# EAGLE design nedo1820_v1_0 (EAGLE 5.01)
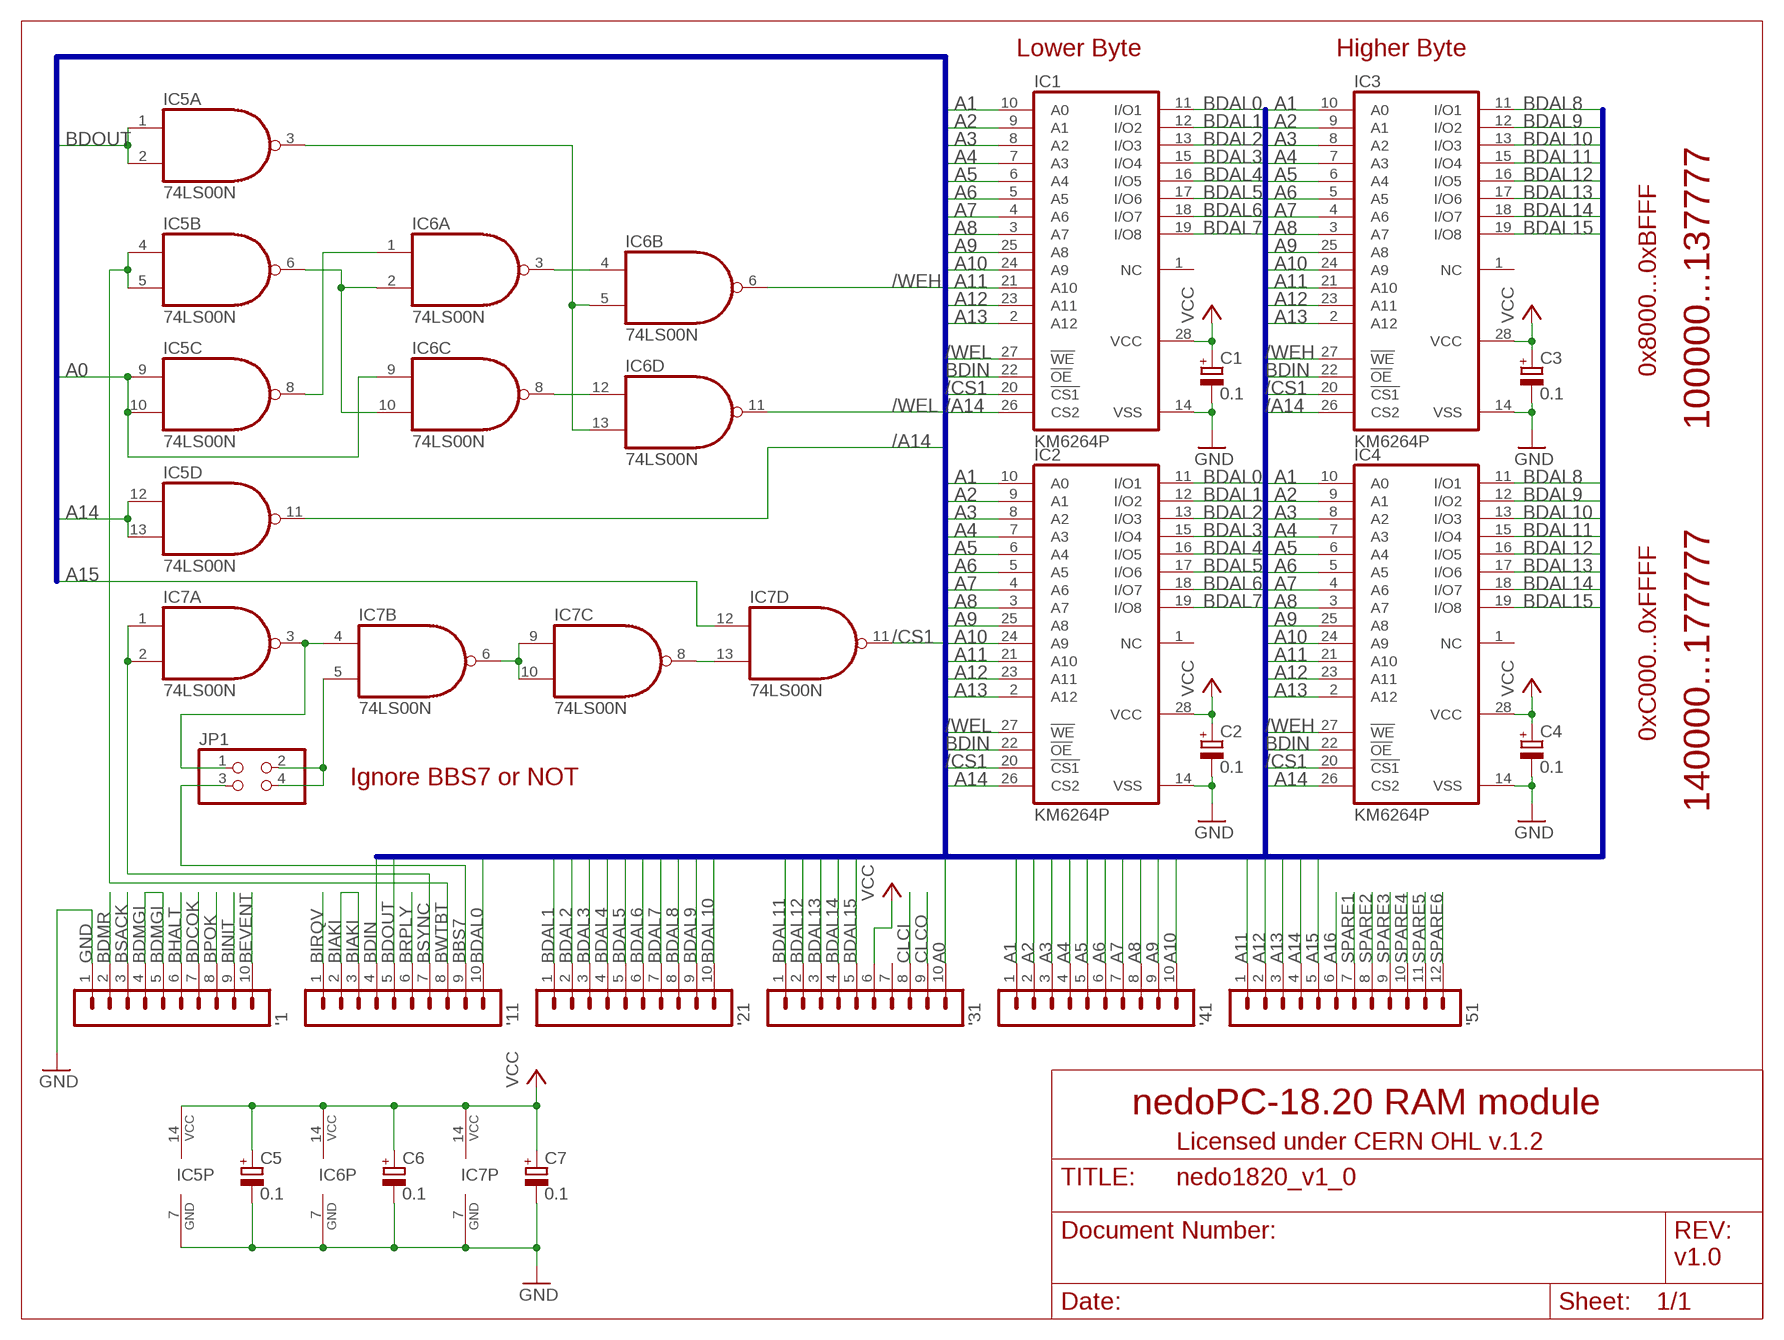
[diagram p0: schematic, sheet 1]

## Parts
'1  MA10-1  [MA10-1]
'11  MA10-1  [MA10-1]
'21  MA10-1  [MA10-1]
'31  MA10-1  [MA10-1]
'41  MA10-1  [MA10-1]
'51  MA12-1  [MA12-1]
C1  0.1  CPOL-EUB45181B  [B45181B]
C2  0.1  CPOL-EUB45181B  [B45181B]
C3  0.1  CPOL-EUB45181B  [B45181B]
C4  0.1  CPOL-EUB45181B  [B45181B]
C5  0.1  CPOL-EUB45181B  [B45181B]
C6  0.1  CPOL-EUB45181B  [B45181B]
C7  0.1  CPOL-EUB45181B  [B45181B]
IC1  KM6264P  6264A  [DIL28-6]
IC2  KM6264P  6264A  [DIL28-6]
IC3  KM6264P  6264A  [DIL28-6]
IC4  KM6264P  6264A  [DIL28-6]
IC5  74LS00N  [DIL14]
IC6  74LS00N  [DIL14]
IC7  74LS00N  [DIL14]
JP1  PINHD-2X2  [2X02]

## Nets
/A14: IC1.26(CS2) IC3.26(CS2) IC5.11(D:O)
/CS1: IC1.20(!CS1) IC2.20(!CS1) IC3.20(!CS1) IC4.20(!CS1) IC7.11(D:O)
/WEH: IC3.27(!WE) IC4.27(!WE) IC6.6(B:O)
/WEL: IC1.27(!WE) IC2.27(!WE) IC6.11(D:O)
A0: '31.10 IC5.9(C:I0) IC5.10(C:I1) IC6.9(C:I0)
A1: '41.1 IC1.10(A0) IC2.10(A0) IC3.10(A0) IC4.10(A0)
A2: '41.2 IC1.9(A1) IC2.9(A1) IC3.9(A1) IC4.9(A1)
A3: '41.3 IC1.8(A2) IC2.8(A2) IC3.8(A2) IC4.8(A2)
A4: '41.4 IC1.7(A3) IC2.7(A3) IC3.7(A3) IC4.7(A3)
A5: '41.5 IC1.6(A4) IC2.6(A4) IC3.6(A4) IC4.6(A4)
A6: '41.6 IC1.5(A5) IC2.5(A5) IC3.5(A5) IC4.5(A5)
A7: '41.7 IC1.4(A6) IC2.4(A6) IC3.4(A6) IC4.4(A6)
A8: '41.8 IC1.3(A7) IC2.3(A7) IC3.3(A7) IC4.3(A7)
A9: '41.9 IC1.25(A8) IC2.25(A8) IC3.25(A8) IC4.25(A8)
A10: '41.10 IC1.24(A9) IC2.24(A9) IC3.24(A9) IC4.24(A9)
A11: '51.1 IC1.21(A10) IC2.21(A10) IC3.21(A10) IC4.21(A10)
A12: '51.2 IC1.23(A11) IC2.23(A11) IC3.23(A11) IC4.23(A11)
A13: '51.3 IC1.2(A12) IC2.2(A12) IC3.2(A12) IC4.2(A12)
A14: '51.4 IC2.26(CS2) IC4.26(CS2) IC5.12(D:I0) IC5.13(D:I1)
A15: '51.5 IC7.12(D:I0)
A16: '51.6
BBS7: '11.9 JP1.3
BDAL0: '11.10 IC1.11(I/O1) IC2.11(I/O1)
BDAL1: '21.1 IC1.12(I/O2) IC2.12(I/O2)
BDAL2: '21.2 IC1.13(I/O3) IC2.13(I/O3)
BDAL3: '21.3 IC1.15(I/O4) IC2.15(I/O4)
BDAL4: '21.4 IC1.16(I/O5) IC2.16(I/O5)
BDAL5: '21.5 IC1.17(I/O6) IC2.17(I/O6)
BDAL6: '21.6 IC1.18(I/O7) IC2.18(I/O7)
BDAL7: '21.7 IC1.19(I/O8) IC2.19(I/O8)
BDAL8: '21.8 IC3.11(I/O1) IC4.11(I/O1)
BDAL9: '21.9 IC3.12(I/O2) IC4.12(I/O2)
BDAL10: '21.10 IC3.13(I/O3) IC4.13(I/O3)
BDAL11: '31.1 IC3.15(I/O4) IC4.15(I/O4)
BDAL12: '31.2 IC3.16(I/O5) IC4.16(I/O5)
BDAL13: '31.3 IC3.17(I/O6) IC4.17(I/O6)
BDAL14: '31.4 IC3.18(I/O7) IC4.18(I/O7)
BDAL15: '31.5 IC3.19(I/O8) IC4.19(I/O8)
BDCOK: '1.7
BDIN: '11.4 IC1.22(!OE) IC2.22(!OE) IC3.22(!OE) IC4.22(!OE)
BDMGI: '1.4 '1.5
BDMR: '1.2
BDOUT: '11.5 IC5.1(A:I0) IC5.2(A:I1)
BEVENT: '1.10
BHALT: '1.6
BIAKI: '11.2 '11.3
BINIT: '1.9
BIRQV: '11.1
BPOK: '1.8
BRPLY: '11.6
BSACK: '1.3
BSYNC: '11.7 IC7.1(A:I0) IC7.2(A:I1)
BWTBT: '11.8 IC5.4(B:I0) IC5.5(B:I1)
CLCI: '31.8
CLCO: '31.9
GND: '1.1 C1.- C2.- C3.- C4.- C5.- C6.- C7.- IC1.14(VSS) IC2.14(VSS) IC3.14(VSS) IC4.14(VSS) IC5.7(P:GND) IC6.7(P:GND) IC7.7(P:GND)
N$1: IC7.3(A:O) IC7.4(B:I0) JP1.1
N$2: IC7.6(B:O) IC7.9(C:I0) IC7.10(C:I1)
N$3: IC7.8(C:O) IC7.13(D:I1)
N$4: IC6.3(A:O) IC6.4(B:I0)
N$5: IC6.8(C:O) IC6.12(D:I0)
N$6: IC7.5(B:I1) JP1.2 JP1.4
N$8: IC5.3(A:O) IC6.5(B:I1) IC6.13(D:I1)
N$9: IC5.6(B:O) IC6.2(A:I1) IC6.10(C:I1)
N$10: IC5.8(C:O) IC6.1(A:I0)
SPARE1: '51.7
SPARE2: '51.8
SPARE3: '51.9
SPARE4: '51.10
SPARE5: '51.11
SPARE6: '51.12
VCC: '31.6 C1.+ C2.+ C3.+ C4.+ C5.+ C6.+ C7.+ IC1.28(VCC) IC2.28(VCC) IC3.28(VCC) IC4.28(VCC) IC5.14(P:VCC) IC6.14(P:VCC) IC7.14(P:VCC)
Unconnected: '31.7 IC1.1(NC) IC2.1(NC) IC3.1(NC) IC4.1(NC)

## Buses
A[0..15],BDAL[0..15],BDIN,BDOUT,/WEL,/WEH,/CS1,/A14

## Notes on the sheet
- Lower Byte | Higher Byte
- 0x8000...0xBFFF
- 100000...137777
- 0xC000...0xFFFF
- Ignore BBS7 or NOT
- 140000...177777
- nedoPC-18.20 RAM module
- Licensed under CERN OHL v.1.2
- v1.0

## Library data of the parts
'1 '11 '21 '31 '41 = con-lstb:MA10-1: PIN HEADER
'51 = con-lstb:MA12-1: PIN HEADER
C1-C7 = rcl:CPOL-EU: POLARIZED CAPACITOR, European symbol
IC1-IC4 = memory-hitachi:6264A: MEMORY
IC5-IC7 = 74xx-us:74*00: Quad 2-input NAND gate
JP1 = pinhead:PINHD-2X2: PIN HEADER

## Board
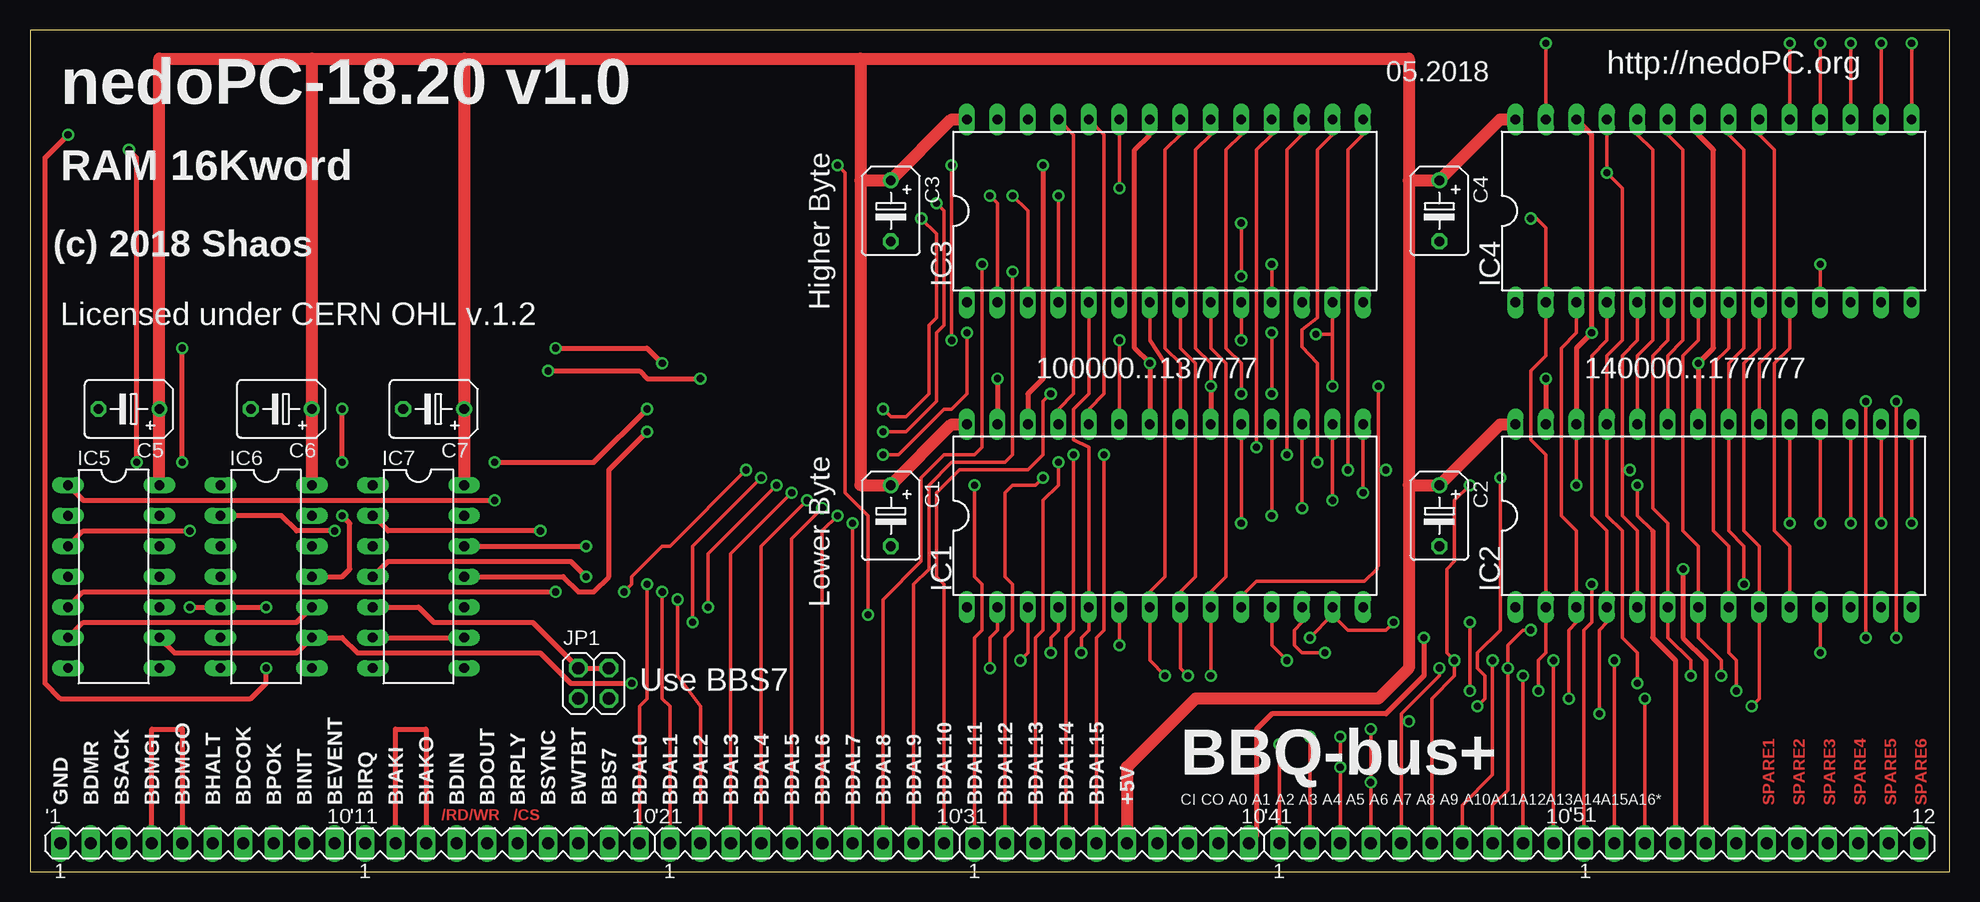
[diagram p1: board, top side]
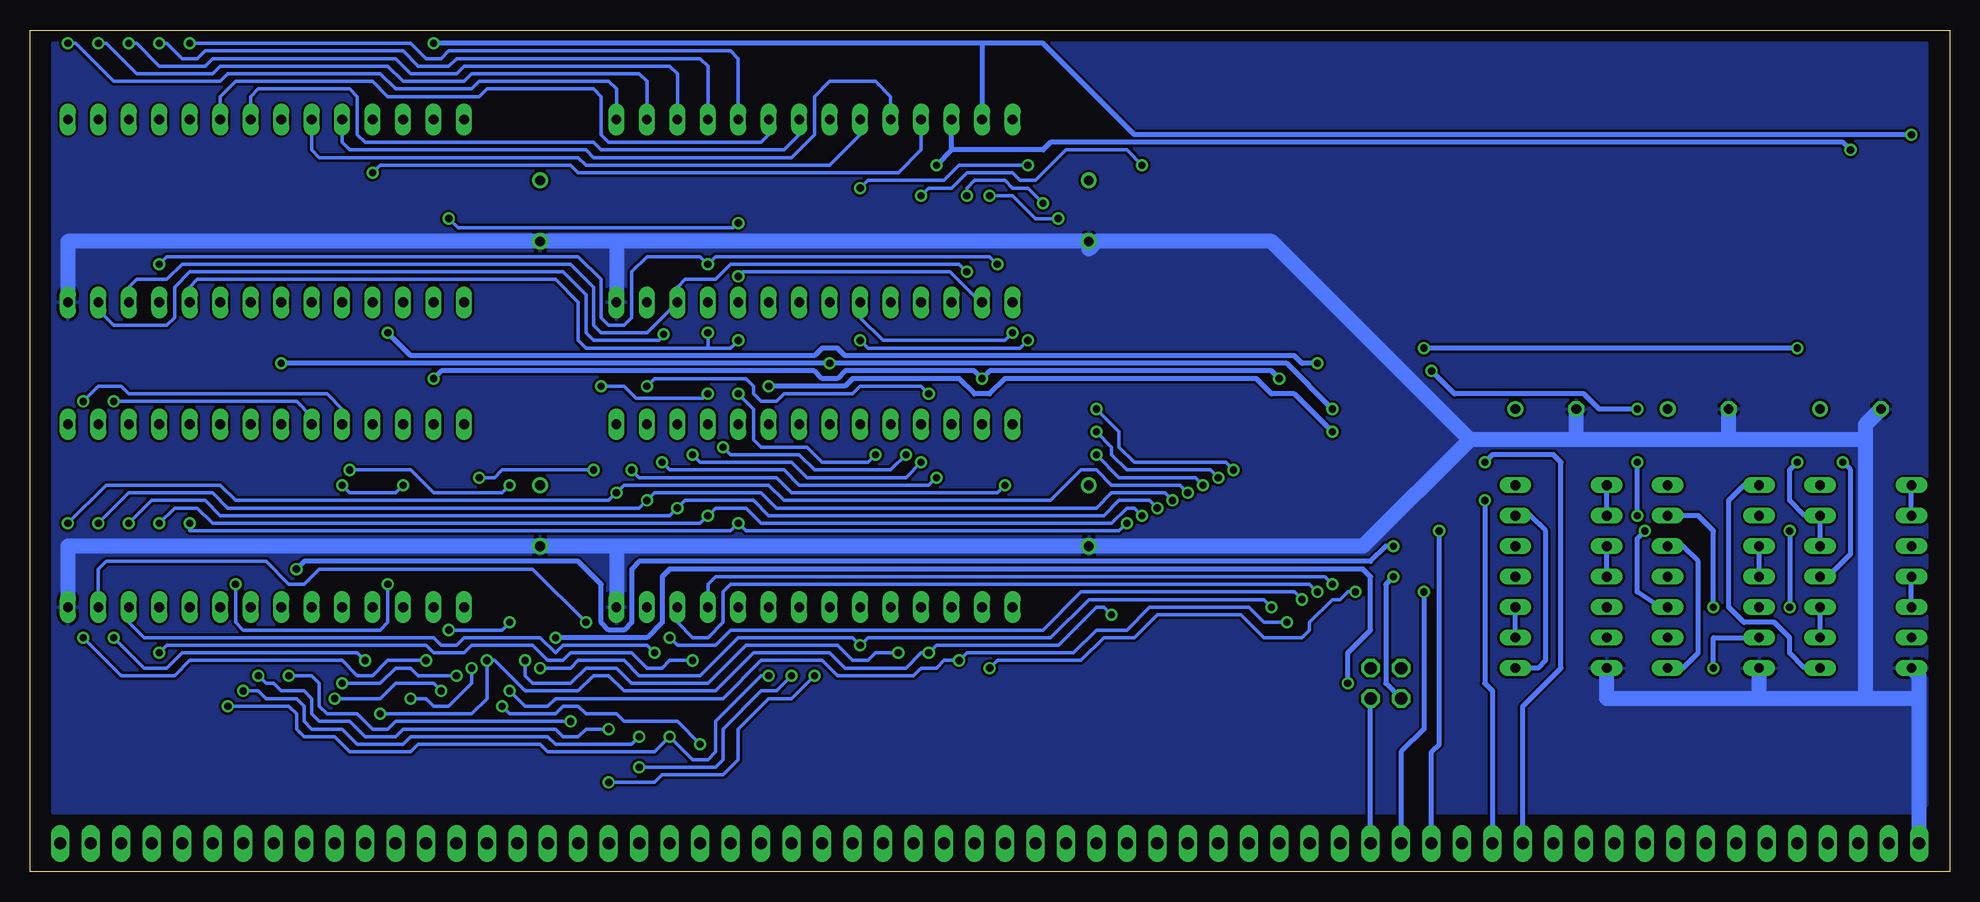
[diagram p2: board, bottom side, seen from below]

Size 160 x 70.16 mm. Coordinates in mm from the lower left corner, seen from the top.
Outline: 0,0 160,0 160,70.16 0,70.16 0,0
Copper layers (1+2*15+16): Top 0.035mm / dielectric 1.5mm / Route2 0.035mm / dielectric 0.15mm / Route15 0.035mm / dielectric 0.2mm / Bottom 0.035mm
Design rules "default *": minimum track width 6mil, minimum drill 20mil, track to track 8mil, track to pad 8mil, pad to pad 8mil, via to via 8mil, smd to smd 8mil, copper to edge 20mil, drill to drill 8mil, minimum pad ring 10mil, minimum via ring 8mil, stop-mask expansion 4mil, vias tented up to drill 0mil, thermal gap 10mil

### Footprints (pad centres in the part's own frame; a part is rotated, then mirrored left to right if it is on the bottom)
MA10-1 = drill 1.016 long: 1 -11.43,0; 2 -8.89,0; 3 -6.35,0; 4 -3.81,0; 5 -1.27,0; 6 1.27,0; 7 3.81,0; 8 6.35,0; 9 8.89,0; 10 11.43,0
MA12-1 = drill 1.016 long: 1 -13.97,0; 2 -11.43,0; 3 -8.89,0; 4 -6.35,0; 5 -3.81,0; 6 -1.27,0; 7 1.27,0; 8 3.81,0; 9 6.35,0; 10 8.89,0; 11 11.43,0; 12 13.97,0
B45181B = drill 0.813 round: + -2.54,0 | drill 0.813 octagon: - 2.54,0
DIL28-6 = drill 0.813 long: 1 -16.51,-7.62; 2 -13.97,-7.62; 3 -11.43,-7.62; 4 -8.89,-7.62; 5 -6.35,-7.62; 6 -3.81,-7.62; 7 -1.27,-7.62; 8 1.27,-7.62; 9 3.81,-7.62; 10 6.35,-7.62; 11 8.89,-7.62; 12 11.43,-7.62; 13 13.97,-7.62; 14 16.51,-7.62; 15 16.51,7.62; 16 13.97,7.62; 17 11.43,7.62; 18 8.89,7.62; 19 6.35,7.62; 20 3.81,7.62; 21 1.27,7.62; 22 -1.27,7.62; 23 -3.81,7.62; 24 -6.35,7.62; 25 -8.89,7.62; 26 -11.43,7.62; 27 -13.97,7.62; 28 -16.51,7.62
DIL14 = drill 0.813 long: 1 -7.62,-3.81; 2 -5.08,-3.81; 3 -2.54,-3.81; 4 0,-3.81; 5 2.54,-3.81; 6 5.08,-3.81; 7 7.62,-3.81; 8 7.62,3.81; 9 5.08,3.81; 10 2.54,3.81; 11 0,3.81; 12 -2.54,3.81; 13 -5.08,3.81; 14 -7.62,3.81
2X02 = drill 1.016 octagon: 1 -1.27,-1.27; 2 -1.27,1.27; 3 1.27,-1.27; 4 1.27,1.27

### Placement (x,y rotation side)
'1  13.97,2.38 0 top
'11  39.37,2.38 0 top
'21  64.77,2.38 0 top
'31  90.16,2.38 0 top
'41  115.56,2.38 0 top
'51  143.5,2.38 0 top
C1  71.75,29.68 270 top
C2  117.47,29.68 270 top
C3  71.75,55.08 270 top
C4  117.47,55.08 270 top
C5  8.25,38.57 180 top
C6  20.95,38.57 180 top
C7  33.65,38.57 180 top
IC1  94.61,29.68 0 top
IC2  140.33,29.68 0 top
IC3  94.61,55.08 0 top
IC4  140.33,55.08 0 top
IC5  6.98,24.6 270 top
IC6  19.68,24.6 270 top
IC7  32.38,24.6 270 top
JP1  46.98,15.71 0 top

### Tracks (layer width: path | path; a pad name or v marks a point on that pad's centre or on a via)
/A14  (via drill 0.6)
  Top 0.406: v8.89,34.12 8.89,59.52 v8.25,60.16 | v84.45,58.89 84.45,41.11 83.18,39.84 IC1.26
  Bottom 0.406: IC5.11 10.16,24.6 8.25,26.5 8.25,33.49 v8.89,34.12 | v8.25,60.16 8.89,60.8 74.92,60.8 75.56,60.16 83.18,60.16 | 83.18,60.16 v84.45,58.89 | 83.18,60.16 IC3.26
/CS1  (via drill 0.6)
  Top 0.305: IC4.20 144.14,61.43 145.41,60.16 145.41,43.65 144.14,42.38 IC2.20 | v98.42,40.48 98.42,42.38 97.15,43.65 97.15,60.16 98.42,61.43 IC3.20
  Top 0.406: IC7.11 44.45,24.6 45.72,23.33 46.98,23.33 48.26,24.6 48.26,33.49 v51.43,36.66 | v98.42,40.48 IC1.20
  Bottom 0.305: IC3.20 98.42,61.43 99.05,60.8 111.75,60.8 112.39,61.43 112.39,64.61 113.02,65.24 121.91,65.24 122.55,64.61 130.17,64.61 131.44,65.88 142.87,65.88 144.14,64.61 IC4.20
  Bottom 0.406: v51.43,36.66 54.61,39.84 56.51,39.84 57.78,41.11 78.73,41.11 80,39.84 81.27,39.84 82.55,41.11 91.44,41.11 92.07,40.48 v98.42,40.48
/WEH  (via drill 0.6)
  Top 0.305: v126.36,69.05 IC4.27
  Top 0.406: v19.68,16.98 19.68,15.71 18.41,14.44 2.54,14.44 1.27,15.71 1.27,59.52 v3.17,61.43
  Bottom 0.406: IC6.6 19.68,19.52 v19.68,16.98 | v3.17,61.43 67.94,61.43 75.56,69.05 80.64,69.05 | 80.64,69.05 v126.36,69.05 | 80.64,69.05 IC3.27
/WEL  (via drill 0.6)
  Top 0.406: IC6.11 26.03,24.6 26.66,25.23 26.66,29.04 v26.03,29.68 | v26.03,34.12 v26.03,38.57 | v43.18,41.74 50.8,41.74 51.43,41.11 v55.88,41.11 | v126.36,41.11 IC2.27 | v80.64,41.11 IC1.27
  Bottom 0.406: v26.03,29.68 v26.03,34.12 | v26.03,38.57 29.2,38.57 30.47,39.84 41.27,39.84 v43.18,41.74 | v55.88,41.11 56.51,41.74 80,41.74 v80.64,41.11 81.27,41.74 92.07,41.74 92.7,41.11 93.97,41.11 94.61,41.74 125.72,41.74 v126.36,41.11
A0  (via drill 0.6)
  Top 0.406: IC5.9 12.06,18.25 22.22,18.25 IC6.9 26.03,19.52 27.3,18.25 42.54,18.25 45.08,15.71 v50.16,15.71 | '31.10 102.23,3.01 102.23,11.9 103.5,13.17 113.02,13.17 116.2,16.34 v116.2,19.52
  Bottom 0.406: IC5.9 IC5.10 | v50.16,15.71 50.16,18.25 48.26,20.15 48.26,24.6 48.89,25.23 106.67,25.23 107.31,24.6 107.31,20.79 108.58,19.52 v116.2,19.52
A1  (via drill 0.6)
  Top 0.305: IC4.10 146.68,43.65 145.41,42.38 145.41,28.41 146.68,27.14 IC2.10 | v100.96,44.28 IC3.10 | IC1.10 100.96,22.95 102.23,24.22 111.25,24.22 112.26,25.23 112.26,25.36 112.39,25.49 112.39,33.49 | 112.39,33.49 v112.39,40.48 | v103.5,39.84 v103.5,44.92 | '41.1 v104.13,10.63 | v120.64,13.81 121.28,14.44 121.28,16.34 120.64,16.98 120.64,18.25 122.55,20.15 v122.55,32.85 | v113.02,33.49 112.39,33.49
  Bottom 0.305: IC4.10 146.68,48.73 146.04,49.37 116.2,49.37 114.3,47.46 114.3,44.28 113.66,43.65 103.5,43.65 | 103.5,43.65 101.59,43.65 v100.96,44.28 | v112.39,40.48 110.48,40.48 109.47,39.46 103.88,39.46 v103.5,39.84 | v103.5,44.92 103.5,43.65 | v104.13,10.63 106.04,12.54 110.48,12.54 111.12,13.17 113.66,13.17 114.3,13.81 115.56,13.81 116.2,13.17 120.01,13.17 v120.64,13.81 | v122.55,32.85 121.28,32.85 120.64,33.49 v113.02,33.49
A2  (via drill 0.6)
  Top 0.305: IC4.9 144.14,43.65 142.87,42.38 142.87,28.41 144.14,27.14 IC2.9 144.14,14.44 v143.5,13.81 | IC3.9 98.42,43.65 99.69,42.38 99.69,24.6 98.42,23.33 IC1.9 v98.42,16.34 | '41.2 v106.67,11.27
  Bottom 0.305: v143.5,13.81 138.42,13.81 137.79,13.17 137.79,11.9 137.16,11.27 134.62,11.27 133.34,10 128.27,10 127.63,10.63 117.47,10.63 116.83,10 107.94,10 v106.67,11.27 104.77,9.36 103.5,9.36 102.86,10 102.86,12.54 99.05,16.34 v98.42,16.34
A3  (via drill 0.6)
  Top 0.305: IC4.8 141.6,43.65 140.33,42.38 140.33,28.41 141.6,27.14 IC2.8 141.6,18.25 142.23,17.61 v142.23,15.08 | IC3.8 95.88,43.65 97.15,42.38 97.15,24.6 95.88,23.33 IC1.8 95.88,16.98 v96.52,16.34 | '41.3 v109.21,8.73 v109.21,11.27
  Bottom 0.305: v142.23,15.08 140.97,15.08 140.33,14.44 137.79,14.44 137.16,13.81 137.16,12.54 136.52,11.9 133.98,11.9 132.71,10.63 128.9,10.63 128.27,11.27 116.83,11.27 116.2,10.63 109.85,10.63 v109.21,11.27 | v96.52,16.34 97.78,15.08 99.05,15.08 102.23,11.9 102.23,9.36 102.86,8.73 v109.21,8.73
A4  (via drill 0.6)
  Top 0.305: IC4.7 139.06,44.28 137.79,43.02 137.79,28.41 139.06,27.14 IC2.7 139.06,19.52 140.97,17.61 v140.97,16.34 | IC3.7 93.34,44.28 94.61,42.38 94.61,24.6 93.34,23.33 IC1.7 93.34,17.61 v94.61,16.34 | '41.4 v111.75,7.46 v111.75,11.9
  Bottom 0.305: v140.97,16.34 140.33,15.71 139.69,15.71 139.06,15.08 137.16,15.08 136.52,14.44 136.52,13.17 135.88,12.54 133.34,12.54 132.07,11.27 129.53,11.27 128.9,11.9 116.2,11.9 115.56,11.27 114.3,11.27 113.66,11.9 v111.75,11.9 | v94.61,16.34 96.52,14.44 98.42,14.44 100.96,11.9 100.96,9.36 102.23,8.09 107.31,8.09 107.94,7.46 v111.75,7.46
A5  (via drill 0.6)
  Top 0.305: IC4.6 136.52,44.28 135.25,43.02 135.25,30.31 136.52,29.04 IC2.6 136.52,19.52 138.42,17.61 v138.42,16.34 | v78.1,44.92 78.1,39.84 76.83,38.57 76.19,38.57 72.38,34.76 v71.11,34.76 | v90.8,18.88 IC1.6 | v56.51,22.06 56.51,26.5 v62.23,32.22 | v117.47,16.98 117.47,16.34 116.83,15.71 114.3,13.17 114.3,12.54 | 114.3,12.54 '41.5 | 114.3,12.54 v114.93,12.54
  Bottom 0.305: IC3.6 90.8,46.19 88.89,44.28 78.73,44.28 v78.1,44.92 | v62.23,32.22 62.86,32.85 69.21,32.85 v71.11,34.76 | v56.51,22.06 57.15,22.7 71.75,22.7 74.92,19.52 90.16,19.52 v90.8,18.88 91.44,19.52 100.96,19.52 104.13,16.34 109.21,16.34 110.48,17.61 114.3,17.61 114.93,16.98 v117.47,16.98 | v138.42,16.34 136.52,16.34 135.88,15.71 135.88,13.81 135.25,13.17 132.71,13.17 131.44,11.9 130.17,11.9 129.53,12.54 v114.93,12.54
A6  (via drill 0.6)
  Top 0.305: IC4.5 133.98,44.28 132.71,43.02 132.71,33.49 | 132.71,33.49 132.71,29.68 133.98,28.41 IC2.5 | IC3.5 88.26,39.84 86.99,38.57 86.99,36.03 88.26,35.39 IC1.5 88.26,20.15 87.62,19.52 v87.62,18.25 | '41.6 116.83,14.44 118.74,16.34 v118.74,17.61 118.1,18.25 118.1,25.23 118.74,25.87 118.74,30.95 v120.01,32.22 | v133.34,33.49 132.71,33.49
  Bottom 0.305: v120.01,32.22 120.64,31.58 126.36,31.58 128.27,33.49 v133.34,33.49 | v87.62,18.25 89.53,18.25 90.16,17.61 91.44,17.61 92.7,18.88 100.32,18.88 103.5,15.71 109.85,15.71 111.12,16.98 113.66,16.98 114.93,15.71 118.1,15.71 118.74,16.34 v118.74,17.61
A7  (via drill 0.6)
  Top 0.305: IC4.4 131.44,44.28 130.17,43.02 130.17,29.68 131.44,28.41 IC2.4 131.44,20.79 130.81,20.15 v130.81,13.17 | v85.72,56.35 IC3.4 | v67.3,58.89 67.94,58.25 67.94,31.58 69.84,29.68 v69.84,21.42 | v85.08,18.25 85.08,19.52 85.72,20.15 IC1.4 | v121.91,17.61 121.91,8.09 119.38,5.55 '41.7
  Bottom 0.305: v85.72,56.35 85.08,56.98 83.18,56.98 81.91,58.25 78.1,58.25 77.46,57.62 76.19,57.62 73.66,60.16 68.57,60.16 v67.3,58.89 | v69.84,21.42 70.48,22.06 71.11,22.06 74.29,18.88 84.45,18.88 v85.08,18.25 85.72,18.25 86.99,16.98 92.07,16.98 93.34,18.25 99.69,18.25 102.86,15.08 110.48,15.08 111.75,16.34 113.02,16.34 114.3,15.08 118.74,15.08 121.28,17.61 v121.91,17.61 121.91,14.44 123.19,13.17 v130.81,13.17
A8  (via drill 0.6)
  Top 0.305: IC4.3 128.9,44.92 127.63,43.65 127.63,29.68 128.9,28.41 IC2.3 128.9,20.79 128.27,20.15 v128.27,14.44 | IC1.3 83.18,18.25 v82.55,17.61 | v55.24,20.79 55.24,27.14 v60.96,32.85 | v71.11,36.66 73.02,36.66 75.56,39.2 75.56,44.92 76.19,45.55 76.19,55.08 v75.56,55.71 | IC3.3 83.18,55.08 v81.91,56.35 | '41.8 121.91,5.55 123.19,6.82 v123.19,16.98 123.19,18.88 124.45,20.15 v125.09,20.15 | v120.01,15.08 v120.01,20.79
  Bottom 0.305: v55.24,20.79 57.15,20.79 58.41,22.06 66.67,22.06 68.57,20.15 71.11,20.15 73.02,18.25 81.91,18.25 v82.55,17.61 83.81,17.61 84.45,16.98 85.72,16.98 86.35,16.34 92.7,16.34 93.97,17.61 99.05,17.61 102.23,14.44 116.2,14.44 116.83,13.81 118.74,13.81 v120.01,15.08 | v60.96,32.85 61.59,33.49 68.57,33.49 69.84,34.76 69.84,35.39 v71.11,36.66 | v81.91,56.35 81.91,56.98 81.27,57.62 78.73,57.62 78.1,56.98 76.83,56.98 v75.56,55.71 | v128.27,14.44 126.99,14.44 126.36,13.81 125.09,13.81 123.19,15.71 v123.19,16.98 | v120.01,20.79 120.64,20.15 v125.09,20.15
A9  (via drill 0.6)
  Top 0.305: IC4.25 v131.44,58.25 132.71,56.98 132.71,44.28 131.44,43.02 IC2.25 131.44,29.68 132.71,28.41 132.71,19.52 133.98,18.25 v133.98,15.71 | IC1.25 85.72,38.57 86.99,39.84 86.99,61.43 IC3.25 | v124.45,16.34 '41.9
  Bottom 0.305: v131.44,58.25 130.81,58.89 114.93,58.89 114.3,58.25 87.62,58.25 85.72,60.16 IC3.25 | v133.98,15.71 130.81,15.71 129.53,16.98 128.27,16.98 127.63,16.34 v124.45,16.34
A10  (via drill 0.6)
  Top 0.305: IC1.24 88.26,38.57 89.53,39.84 89.53,61.43 IC3.24 | IC2.24 133.98,43.02 135.25,44.28 135.25,60.16 133.98,61.43 IC4.24 | v155.57,39.2 v155.57,19.52 | v126.99,17.61 '41.10
  Bottom 0.305: IC4.24 133.98,60.8 133.34,60.16 113.66,60.16 113.02,59.52 96.52,59.52 94.61,61.43 94.61,64.61 93.34,65.88 89.53,65.88 88.26,64.61 IC3.24 88.26,62.06 | IC2.24 133.98,38.57 135.25,39.84 151.76,39.84 152.39,40.48 154.3,40.48 v155.57,39.2 | v155.57,19.52 152.39,16.34 147.95,16.34 146.68,17.61 133.98,17.61 132.71,16.34 131.44,16.34 130.17,17.61 v126.99,17.61
A11  (via drill 0.6)
  Top 0.305: IC4.21 141.6,61.43 142.87,60.16 142.87,43.65 141.6,42.38 IC2.21 141.6,28.41 142.87,27.14 v142.87,23.96 | IC3.21 95.88,61.43 94.61,60.16 94.61,43.65 95.88,42.38 IC1.21 | v130.17,23.96 130.17,20.79 129.53,20.15 '51.1
  Bottom 0.305: IC4.21 141.6,64.61 140.97,65.24 133.34,65.24 132.71,64.61 132.71,61.43 132.07,60.8 113.02,60.8 112.39,60.16 97.15,60.16 95.88,61.43 IC3.21 | v142.87,23.96 142.87,20.79 142.23,20.15 130.81,20.15 130.17,20.79 v130.17,23.96
A12  (via drill 0.6)
  Top 0.305: v90.8,44.28 IC1.23 | v76.83,44.28 v76.83,58.89 | v90.8,56.98 IC3.23 | IC2.23 136.52,43.02 137.79,44.28 137.79,60.16 136.52,61.43 IC4.23 | v153.03,39.2 v153.03,19.52 | v132.07,17.61 '51.2
  Bottom 0.305: IC4.23 136.52,60.16 135.88,59.52 114.3,59.52 113.66,58.89 93.34,58.89 90.8,61.43 IC3.23 | v90.8,44.28 90.16,43.65 77.46,43.65 v76.83,44.28 | v76.83,58.89 82.55,58.89 83.81,57.62 90.16,57.62 v90.8,56.98 | IC2.23 136.52,37.94 137.79,39.2 v153.03,39.2 | v153.03,19.52 150.49,16.98 148.59,16.98 147.31,18.25 132.71,18.25 v132.07,17.61
A13  (via drill 0.6)
  Top 0.305: v100.96,49.62 v100.96,54.06 | v125.09,54.45 125.6,54.45 126.36,53.68 IC4.2 126.36,43.02 125.09,41.74 125.09,36.03 126.36,34.76 IC2.2 126.36,18.25 125.72,17.61 v125.72,15.08 | IC3.2 80.64,55.71 v80,56.35 | v74.29,54.45 75.56,53.17 75.56,46.19 74.92,45.55 74.92,39.84 73.02,37.94 71.75,37.94 v71.11,38.57 | v59.69,33.49 53.34,27.14 52.7,27.14 50.16,24.6 50.16,23.96 v49.53,23.33 | v80,16.98 80,19.52 80.64,20.15 IC1.2 | v134.62,14.44 '51.3
  Bottom 0.305: v100.96,49.62 100.58,50 83.31,50 80.77,47.46 IC3.2 | v100.96,54.06 101.34,53.68 124.33,53.68 v125.09,54.45 | v80,56.35 78.1,56.35 76.19,54.45 v74.29,54.45 | v71.11,38.57 69.21,36.66 69.21,35.39 67.94,34.12 60.32,34.12 v59.69,33.49 | v49.53,23.33 50.16,23.33 50.8,22.7 51.43,22.7 53.34,20.79 53.34,20.15 53.97,19.52 57.15,19.52 59.05,21.42 66.03,21.42 67.94,19.52 70.48,19.52 72.38,17.61 79.37,17.61 v80,16.98 | v134.62,14.44 130.81,14.44 129.53,15.71 126.36,15.71 v125.72,15.08
A14  (via drill 0.6)
  Top 0.305: 135.25,28.41 133.98,29.68 v133.98,32.22 | IC2.26 v128.9,32.22
  Top 0.406: v12.7,34.12 v12.7,43.65 | v43.81,43.65 51.43,43.65 v52.7,42.38 | IC2.26 128.9,43.65 v130.17,44.92 130.17,61.43 IC4.26 | '51.4 137.16,17.61 135.25,19.52 135.25,28.41
  Bottom 0.305: v133.98,32.22 133.34,31.58 129.53,31.58 v128.9,32.22
  Bottom 0.406: IC5.12 IC5.13 12.06,29.68 13.33,30.95 13.33,33.49 v12.7,34.12 | v12.7,43.65 v43.81,43.65 | v52.7,42.38 53.97,42.38 54.61,43.02 92.07,43.02 92.7,43.65 93.97,43.65 94.61,43.02 128.27,43.02 v130.17,44.92
A15  (via drill 0.6)
  Top 0.406: '51.5 139.69,17.61 137.79,19.52 v137.79,25.23 | IC7.12 v46.35,27.14
  Bottom 0.406: v46.35,27.14 46.98,27.14 48.26,25.87 109.21,25.87 109.85,25.23 109.85,20.79 110.48,20.15 111.75,20.15 112.39,20.79 112.39,23.96 114.3,25.87 137.16,25.87 v137.79,25.23
BBS7
  Bottom 0.406: '11.9 JP1.3
BDAL0  (via drill 0.6)
  Top 0.305: '11.10 50.8,13.81 51.43,14.44 v51.43,23.96 | IC1.11 103.5,18.88 v104.77,17.61 | v149.22,18.25 IC2.11
  Bottom 0.305: v51.43,23.96 52.07,24.6 102.86,24.6 103.5,23.96 IC1.11 | v104.77,17.61 106.67,17.61 107.31,16.98 108.58,16.98 109.85,18.25 114.93,18.25 115.56,17.61 116.83,17.61 118.1,18.88 123.19,18.88 123.82,18.25 126.36,18.25 126.99,18.88 148.59,18.88 v149.22,18.25
BDAL1  (via drill 0.6)
  Top 0.305: '21.1 53.34,13.81 52.7,14.44 v52.7,23.33 | IC1.12 106.04,20.79 105.41,20.15 105.41,18.88 106.04,18.25 v107.94,18.25
  Bottom 0.305: v52.7,23.33 53.34,23.96 101.59,23.96 102.23,23.33 102.23,20.79 103.5,19.52 104.77,19.52 106.04,20.79 IC1.12 | v107.94,18.25 108.58,18.88 115.56,18.88 116.2,18.25 117.47,19.52 123.82,19.52 124.45,18.88 125.72,18.88 126.36,19.52 150.49,19.52 151.76,20.79 IC2.12
BDAL2  (via drill 0.6)
  Top 0.305: '21.2 55.88,13.81 53.97,16.34 v53.97,22.7 | v106.67,19.52 108.58,21.42 | 108.58,21.42 IC1.13 | v113.66,20.79 113.02,20.15 109.85,20.15 108.58,21.42
  Bottom 0.305: v53.97,22.7 54.61,23.33 72.38,23.33 75.56,20.15 101.59,20.15 102.86,18.88 106.04,18.88 v106.67,19.52 | IC2.13 154.3,25.23 153.66,25.87 140.33,25.87 138.42,23.96 137.16,23.96 135.88,25.23 118.1,25.23 v113.66,20.79
BDAL3  (via drill 0.6)
  Top 0.305: v111.12,31.58 IC1.15 | v63.5,31.58 58.41,26.5 '21.3 | v156.84,29.04 IC2.15
  Bottom 0.305: v63.5,31.58 64.13,32.22 69.84,32.22 71.11,33.49 72.38,33.49 74.92,30.95 97.15,30.95 98.42,32.22 110.48,32.22 v111.12,31.58 111.75,30.95 142.87,30.95 144.14,32.22 153.66,32.22 v156.84,29.04
BDAL4  (via drill 0.6)
  Top 0.305: '21.4 60.96,27.14 v64.77,30.95 | v108.58,30.95 IC1.16 | v154.3,29.04 IC2.16
  Bottom 0.305: v64.77,30.95 65.4,31.58 69.84,31.58 71.11,30.31 97.78,30.31 99.05,31.58 107.94,31.58 v108.58,30.95 109.21,30.31 143.5,30.31 144.78,31.58 151.76,31.58 v154.3,29.04
BDAL5  (via drill 0.6)
  Top 0.305: '21.5 63.5,27.77 v66.03,30.31 | v106.04,30.31 IC1.17 | v151.76,29.04 IC2.17
  Bottom 0.305: v66.03,30.31 66.67,30.95 69.21,30.95 70.48,29.68 98.42,29.68 99.69,30.95 105.41,30.95 v106.04,30.31 106.67,29.68 144.14,29.68 145.41,30.95 149.85,30.95 v151.76,29.04
BDAL6  (via drill 0.6)
  Top 0.305: '21.6 66.03,28.41 v67.3,29.68 | v103.5,29.68 IC1.18 | v149.22,29.04 IC2.18
  Bottom 0.305: v67.3,29.68 67.94,30.31 68.57,30.31 69.84,29.04 99.05,29.04 100.32,30.31 102.86,30.31 v103.5,29.68 104.13,29.04 144.78,29.04 146.04,30.31 147.95,30.31 v149.22,29.04
BDAL7  (via drill 0.6)
  Top 0.305: '21.7 v68.57,29.04 | v100.96,29.04 IC1.19 | v146.68,29.04 IC2.19
  Bottom 0.305: v68.57,29.04 69.21,28.41 100.32,28.41 v100.96,29.04 101.59,28.41 146.68,28.41 v146.68,29.04
BDAL8  (via drill 0.6)
  Top 0.305: '21.8 71.11,22.7 74.29,25.87 74.29,32.85 76.19,34.76 78.73,34.76 79.37,35.39 v79.37,50.63 | v103.5,50.63 IC3.11 | v149.22,50.63 IC4.11
  Bottom 0.305: v79.37,50.63 80,51.27 102.86,51.27 v103.5,50.63 104.13,51.27 108.58,51.27 109.85,50 109.85,46.19 110.48,45.55 111.75,45.55 112.39,46.19 112.39,49.37 114.3,51.27 148.59,51.27 v149.22,50.63
BDAL9  (via drill 0.6)
  Top 0.305: '21.9 73.66,23.96 74.92,25.23 74.92,32.22 76.83,34.12 81.27,34.12 81.91,34.76 v81.91,50
  Bottom 0.305: v81.91,50 82.55,50.63 101.59,50.63 102.86,49.37 105.41,49.37 106.04,48.73 IC3.12 107.94,45.55 108.58,44.92 112.39,44.92 113.02,45.55 113.02,48.73 114.93,50.63 147.31,50.63 148.59,49.37 151.12,49.37 151.76,48.73 IC4.12
BDAL10  (via drill 0.6)
  Top 0.305: '21.10 76.19,23.96 75.56,24.6 75.56,31.58 77.46,33.49 83.18,33.49 84.45,34.76 84.45,39.2 v85.08,39.84 | v108.58,40.48 108.58,44.79 | 108.58,44.79 IC3.13 | 108.58,44.79 v107.18,44.79
  Bottom 0.305: v85.08,39.84 85.72,40.48 90.8,40.48 91.44,39.84 97.15,39.84 97.78,39.2 99.05,39.2 99.69,39.84 99.69,40.48 100.32,41.11 107.94,41.11 v108.58,40.48 | IC4.13 154.3,46.82 153.03,45.55 148.59,45.55 147.95,46.19 147.95,48.73 146.68,50 115.56,50 113.66,48.09 113.66,44.92 113.02,44.28 107.56,44.28 v107.18,44.79
BDAL11  (via drill 0.6)
  Top 0.305: '31.1 78.73,19.52 79.37,20.15 79.37,23.96 78.73,24.6 v78.73,32.22 | v109.85,33.49 109.85,60.16 111.12,61.43 IC3.15 | v156.84,69.05 IC4.15
  Bottom 0.305: v78.73,32.22 79.37,31.58 96.52,31.58 97.78,32.85 109.21,32.85 v109.85,33.49 | IC3.15 111.12,65.24 111.75,65.88 122.55,65.88 123.19,65.24 129.53,65.24 130.81,66.51 143.5,66.51 144.14,65.88 153.03,65.88 156.2,69.05 v156.84,69.05
BDAL12  (via drill 0.6)
  Top 0.305: '31.2 81.27,19.52 81.91,20.15 81.91,23.96 81.27,24.6 81.27,31.58 81.91,32.22 83.81,32.22 v84.45,32.85 | v107.31,34.12 107.31,42.38 106.04,43.78 106.04,45.17 107.31,46.19 107.31,60.16 108.58,61.43 IC3.16 | v154.3,69.05 IC4.16
  Bottom 0.305: v84.45,32.85 85.08,32.22 95.88,32.22 97.15,33.49 106.67,33.49 v107.31,34.12 | IC3.16 108.58,65.88 109.21,66.51 123.19,66.51 123.82,65.88 128.9,65.88 130.17,67.14 144.14,67.14 144.78,66.51 151.12,66.51 153.66,69.05 v154.3,69.05
BDAL13  (via drill 0.6)
  Top 0.305: '31.3 83.81,19.52 84.45,20.15 84.45,30.95 85.72,32.22 v85.72,34.12 | v104.77,34.76 104.77,60.16 106.04,61.43 IC3.17 | v151.76,69.05 IC4.17
  Bottom 0.305: v85.72,34.12 86.99,32.85 95.24,32.85 96.52,34.12 104.13,34.12 v104.77,34.76 | IC3.17 106.04,66.51 106.67,67.14 123.82,67.14 124.45,66.51 128.27,66.51 129.53,67.78 144.78,67.78 145.41,67.14 149.22,67.14 151.12,69.05 v151.76,69.05
BDAL14  (via drill 0.6)
  Top 0.305: '31.4 86.35,19.52 86.99,20.15 v86.99,34.76 | v102.23,35.39 102.23,60.16 103.5,61.43 IC3.18 | v149.22,69.05 IC4.18
  Bottom 0.305: v86.99,34.76 88.26,33.49 94.61,33.49 95.88,34.76 101.59,34.76 v102.23,35.39 | IC3.18 103.5,67.14 104.13,67.78 124.45,67.78 125.09,67.14 127.63,67.14 128.9,68.41 145.41,68.41 146.04,67.78 147.31,67.78 148.59,69.05 v149.22,69.05
BDAL15  (via drill 0.6)
  Top 0.305: '31.5 88.89,19.52 89.53,20.15 v89.53,34.76 | v100.96,39.84 100.96,42.38 99.69,43.65 99.69,60.16 100.96,61.43 IC3.19 | v146.68,69.05 IC4.19
  Bottom 0.305: v89.53,34.76 90.16,34.12 93.97,34.12 95.24,35.39 99.05,35.39 99.69,36.03 99.69,38.57 v100.96,39.84 | IC3.19 100.96,67.78 101.59,68.41 125.09,68.41 125.72,67.78 126.99,67.78 128.27,69.05 v146.68,69.05
BDIN  (via drill 0.6)
  Top 0.406: v38.73,34.12 46.98,34.12 v51.43,38.57 | IC1.22 v93.34,42.38 92.07,43.65 92.07,60.16 93.34,61.43 IC3.22 | IC4.22 139.06,61.43 140.33,60.16 140.33,43.65 v139.06,42.38 IC2.22
  Bottom 0.406: '11.4 35.55,13.81 32.38,16.98 32.38,34.12 33.02,34.76 38.1,34.76 v38.73,34.12 | v51.43,38.57 55.24,42.38 v93.34,42.38 v139.06,42.38
BDMGI
  Top 0.406: '1.4 10.16,11.9 12.7,11.9 '1.5
BDOUT  (via drill 0.6)
  Top 0.406: v38.73,30.95 4.44,30.95 IC5.1
  Bottom 0.406: IC5.2 IC5.1 | '11.5 38.1,15.08 38.73,15.71 v38.73,30.95
BIAKI
  Top 0.406: '11.2 30.47,11.9 33.02,11.9 '11.3
BSYNC  (via drill 0.6)
  Top 0.406: v42.54,28.41 29.84,28.41 IC7.2
  Bottom 0.406: IC7.2 IC7.1 | '11.7 43.18,10 42.54,10.63 v42.54,28.41
BWTBT  (via drill 0.6)
  Top 0.406: v43.81,23.33 4.44,23.33 IC5.5
  Bottom 0.406: IC5.5 IC5.4 | '11.8 45.72,10 43.81,11.9 v43.81,23.33
GND
  Bottom 1.27: '1.1 2.54,14.44 | 2.54,14.44 2.54,16.34 IC5.7 | IC6.7 15.87,14.44 15.24,14.44 | 2.54,14.44 6.98,14.44 | 6.98,14.44 15.24,14.44 | IC7.7 28.57,14.44 15.24,14.44 | 111.12,27.14 C1.- 48.89,27.14 40,36.03 | 111.12,27.14 C2.- 156.84,27.14 IC2.14 | 111.12,52.54 C3.- 71.75,51.91 71.11,52.54 56.51,52.54 40,36.03 | 111.12,52.54 C4.- 156.84,52.54 IC4.14 | 6.98,36.03 18.41,36.03 | 18.41,36.03 31.11,36.03 | 31.11,36.03 40,36.03 | 6.98,36.03 6.98,37.3 C5.- | 6.98,14.44 6.98,36.03 | 31.11,36.03 C7.- | 18.41,36.03 C6.- | 111.12,52.54 IC3.14 | 111.12,27.14 IC1.14
  pour Bottom: 1.9,69.05 158.11,69.05 158.11,4.92 2.54,4.92 1.9,5.55
N$1  (via drill 0.6)
  Top 0.406: v46.35,24.6 45.08,25.87 29.84,25.87 IC7.4
  Bottom 0.406: IC7.4 IC7.3 | JP1.1 46.98,15.71 46.98,23.96 v46.35,24.6
N$2
  Top 0.406: IC7.6 IC7.9
  Bottom 0.406: IC7.9 IC7.10
N$3
  Bottom 0.406: IC7.13 34.92,29.68 33.65,28.41 33.65,17.61 34.29,16.98 IC7.8
N$4
  Bottom 0.406: IC6.4 IC6.3
N$5
  Bottom 0.406: IC6.12 22.22,27.14 20.95,25.87 20.95,18.25 22.22,16.98 IC6.8
N$6
  Top 0.406: IC7.5 32.38,22.06 33.65,20.79 41.91,20.79 JP1.2 JP1.4
N$8  (via drill 0.6)
  Top 0.406: v13.33,22.06 IC6.5 v19.68,22.06 | v13.33,28.41 4.44,28.41 IC5.3
  Bottom 0.406: v13.33,28.41 v13.33,22.06 | v19.68,22.06 19.68,28.41 20.95,29.68 IC6.13
N$9  (via drill 0.6)
  Top 0.406: IC5.6 4.44,20.79 22.22,20.79 IC6.10 | IC6.2 20.95,29.68 22.22,28.41 v25.39,28.41
  Bottom 0.406: IC6.10 24.12,22.06 26.03,23.33 26.03,27.77 v25.39,28.41
N$10
  Bottom 0.406: IC5.8 12.06,16.98 13.33,18.25 13.33,19.52 14.6,20.79 17.14,20.79 18.41,22.06 18.41,30.95 17.14,32.22 IC6.1
VCC
  Top 1.016: IC5.14 C5.+ 10.79,67.78 23.49,67.78 | IC6.14 C6.+ 23.49,67.78 | IC7.14 C7.+ 36.19,67.78 | IC1.28 76.83,37.3 C1.+ 69.21,32.22 69.21,57.62 | IC3.28 76.83,62.7 C3.+ 69.21,57.62 | IC4.28 122.55,62.7 C4.+ 114.93,57.62 | IC2.28 122.55,37.3 C2.+ 114.93,32.22 | '31.6 91.44,8.73 97.15,14.44 112.39,14.44 114.93,16.98 114.93,32.22 | 114.93,57.62 114.93,32.22 | 69.21,67.78 69.21,57.62 | 69.21,67.78 114.93,67.78 114.93,57.62 | 23.49,67.78 36.19,67.78 | 36.19,67.78 69.21,67.78

### Text on the board
Top: SPARE1 | SPARE2 | SPARE3 | SPARE4 | SPARE5 | SPARE6 | /RD/WR /CS
tNames: http://nedoPC.org | 05.2018 | nedoPC-18.20 v1.0 | RAM 16Kword | (c) 2018 Shaos | Higher Byte | Licensed under CERN OHL v.1.2 | 100000...137777 | 140000...177777 | Lower Byte | Use BBS7 | BBQ-bus+ | GND | BDMR | BSACK | BDMGI | BDMGO | BHALT | BDCOK | BPOK | BINIT | BEVENT | BIRQ | BIAKI | BIAKO | BDIN | BDOUT | BRPLY | BSYNC | BWTBT | BBS7 | BDAL0 | BDAL1 | BDAL2 | BDAL3 | BDAL4 | BDAL5 | BDAL6 | BDAL7 | BDAL8 | BDAL9 | BDAL10 | BDAL11 | BDAL12 | BDAL13 | BDAL14 | BDAL15 | +5V | CI CO A0 A1 A2 A3 A4 A5 A6 A7 A8 A9 A10A11A12A13A14A15A16*